# EAGLE design thermometer (EAGLE 5.06)
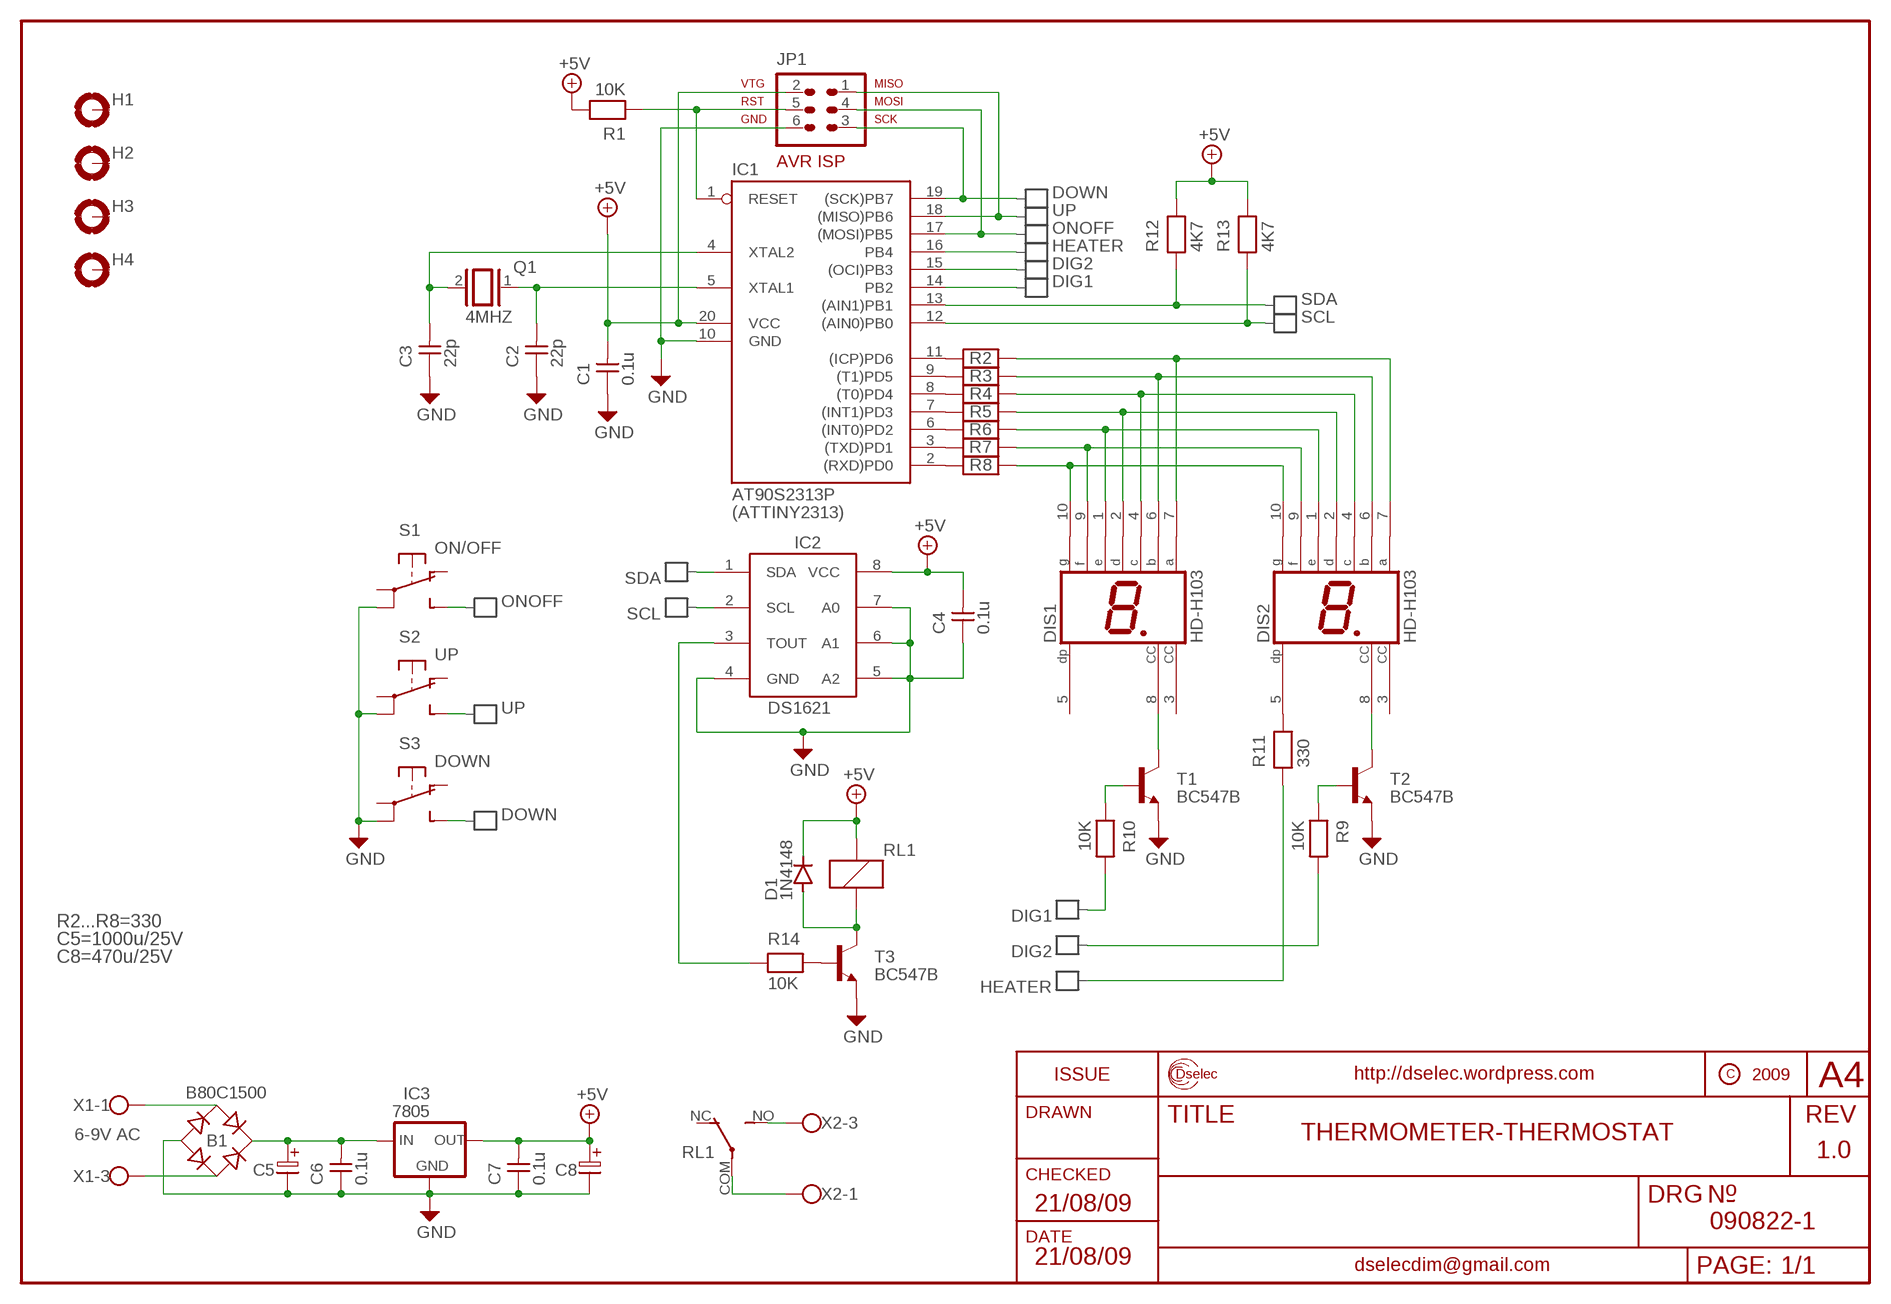
[diagram p0: schematic, sheet 1]

## Parts
B1  B80C1500  RB1A  [RB1A]
C1  0.1u  CAPNP-5  [C-5]
C2  22p  CAPNP-5  [C-5]
C3  22p  CAPNP-5  [C-5]
C4  0.1u  CAPNP-5  [C-5]
C5  ELC-5  [ES-5]
C6  0.1u  CAPNP-5  [C-5]
C7  0.1u  CAPNP-5  [C-5]
C8  ELC-5  [ES-5]
D1  1N4148  [DO35-10]
DIS1  HD-H103  [HDSP-M]
DIS2  HD-H103  [HDSP-M]
H1  MOUNT-PAD-ROUND3.0  [3,0-PAD]
H2  MOUNT-PAD-ROUND3.0  [3,0-PAD]
H3  MOUNT-PAD-ROUND3.0  [3,0-PAD]
H4  MOUNT-PAD-ROUND3.0  [3,0-PAD]
IC1  AT90S2313P  [DIL20]
IC2  DS1621  [DIL08]
IC3  7805  78XXL  [78XXL]
JP1  AVR-ISP-6  [AVR-ISP-6]
Q1  4MHZ  XTAL/S  [QS]
R1  10K  RESEU-10  [R-10]
R2  RESEU-10  [R-10]
R3  RESEU-10  [R-10]
R4  RESEU-10  [R-10]
R5  RESEU-10  [R-10]
R6  RESEU-10  [R-10]
R7  RESEU-10  [R-10]
R8  RESEU-10  [R-10]
R9  10K  RESEU-10  [R-10]
R10  10K  RESEU-10  [R-10]
R11  330  RESEU-10  [R-10]
R12  4K7  RESEU-10  [R-10]
R13  4K7  RESEU-10  [R-10]
R14  10K  RESEU-10  [R-10]
RL1  RELAYSPDTJSM1  [JSM1]
S1  ON/OFF  SRK  [SRK]
S2  UP  SRK  [SRK]
S3  DOWN  SRK  [SRK]
T1  BC547B  BC547B-NPN-TO92-EBC  [TO92-EBC]
T2  BC547B  BC547B-NPN-TO92-EBC  [TO92-EBC]
T3  BC547B  BC547B-NPN-TO92-EBC  [TO92-EBC]
X1  AK500/3  [AK500/3]
X2  AK500/3  [AK500/3]

## Nets
+5V: C1.2 C4.2 C7.2 C8.1 D1.C IC1.20(VCC) IC2.8(VCC) IC3.OUT JP1.2 R1.2 R12.2 R13.2 RL1.1
DIG1: IC1.14(PB2) R10.2
DIG2: IC1.15((OCI)PB3) R9.2
DOWN: IC1.19((SCK)PB7) JP1.3 S3.1(S)
GND: B1.- C1.1 C2.1 C3.1 C4.1 C5.2 C6.1 C7.1 C8.2 IC1.10(GND) IC2.4(GND) IC2.5(A2) IC2.6(A1) IC2.7(A0) IC3.GND JP1.6 S1.3(P) S2.3(P) S3.3(P) T1.E T2.E T3.E
HEATER: IC1.16(PB4) R11.1
N$4: DIS2.5(DP) R11.2
N$5: IC1.1(RESET) JP1.5 R1.1
N$6: RL1.NO(A:NO) X2.3
N$7: IC1.11((ICP)PD6) R2.1
N$8: IC1.9((T1)PD5) R3.1
N$9: IC1.8((T0)PD4) R4.1
N$10: IC1.7((INT1)PD3) R5.1
N$11: IC1.6((INT0)PD2) R6.1
N$12: IC1.3((TXD)PD1) R7.1
N$13: IC1.2((RXD)PD0) R8.1
N$14: C2.2 IC1.5(XTAL1) Q1.1
N$15: C3.2 IC1.4(XTAL2) Q1.2
N$16: DIS1.10(G) DIS2.10(G) R8.2
N$17: DIS1.9(F) DIS2.9(F) R7.2
N$18: DIS1.1(E) DIS2.1(E) R6.2
N$19: DIS1.2(D) DIS2.2(D) R5.2
N$20: DIS1.4(C) DIS2.4(C) R4.2
N$21: DIS1.6(B) DIS2.6(B) R3.2
N$22: DIS1.7(A) DIS2.7(A) R2.2
N$23: R10.1 T1.B
N$24: R9.1 T2.B
N$25: DIS1.8(CC) T1.C
N$26: DIS2.8(CC) T2.C
N$27: D1.A RL1.2 T3.C
N$28: R14.2 T3.B
N$29: RL1.COM(A:COM) X2.1
N$30: B1.AC1 X1.1
N$31: B1.AC2 X1.3
N$33: B1.+ C5.1 C6.2 IC3.IN
ONOFF: IC1.17((MOSI)PB5) JP1.4 S1.1(S)
OUT: IC2.3(TOUT) R14.1
SCL: IC1.12((AIN0)PB0) IC2.2(SCL) R13.1
SDA: IC1.13((AIN1)PB1) IC2.1(SDA) R12.1
UP: IC1.18((MISO)PB6) JP1.1 S2.1(S)
Unconnected: DIS1.3(CC) DIS1.5(DP) DIS2.3(CC) H1.B3,0(MOUNT) H2.B3,0(MOUNT) H3.B3,0(MOUNT) H4.B3,0(MOUNT) RL1.NC(A:NC) S1.2(P) S1.4(O) S2.2(P) S2.4(O) S3.2(P) S3.4(O) X1.2 X2.2

## Notes on the sheet
- (ATTINY2313)
- R2...R8=330
- C5=1000u/25V
- C8=470u/25V
- 6-9V AC | THERMOMETER-THERMOSTAT
- 1.0
- 21/08/09
- 090822-1
- 21/08/09

## Library data of the parts
B1 = rectifier:RB1A: RECTIFIER 1 A
C1-C4 C6 C7 = discrete:CAPNP-5
C5 C8 = discrete:ELC-5
D1 = QuantumOptics:1N4148: 1N4148, fast small signal silicon, 80V 125mAavg trr=4nSmax
DIS1 DIS2 = display-hp:HD-H103: LED DISPLAY 1-character 7 segment, decimal point right
H1-H4 = holes:MOUNT-PAD-ROUND: MOUNTING PAD, round
IC1 = atmel:AT90S2313: MICROCONTROLLER 2 Kbytes FLASH 128 bytes SRAM 128 bytes EEPROM UART
IC2 = maxim:DS1621
IC3 = v-reg:78XXL: VOLTAGE REGULATOR
JP1 = atmel:AVR-ISP-6: AVR ISP-6 Serial Programming Header
Q1 = special:XTAL/S: CRYSTAL
R1-R14 = discrete:RESEU-10
RL1 = ads4:RELAYSPDT: SPDT Relay
S1-S3 = switch-misc:SRK: SWITCH
T1-T3 = transistor:*-NPN-: NPN Transistror BF959 corrected 2008.03.06
X1 X2 = con-ptr500+:AK500/3: CONNECTOR

## Net classes
0 default: width 0.305 mm

## Board
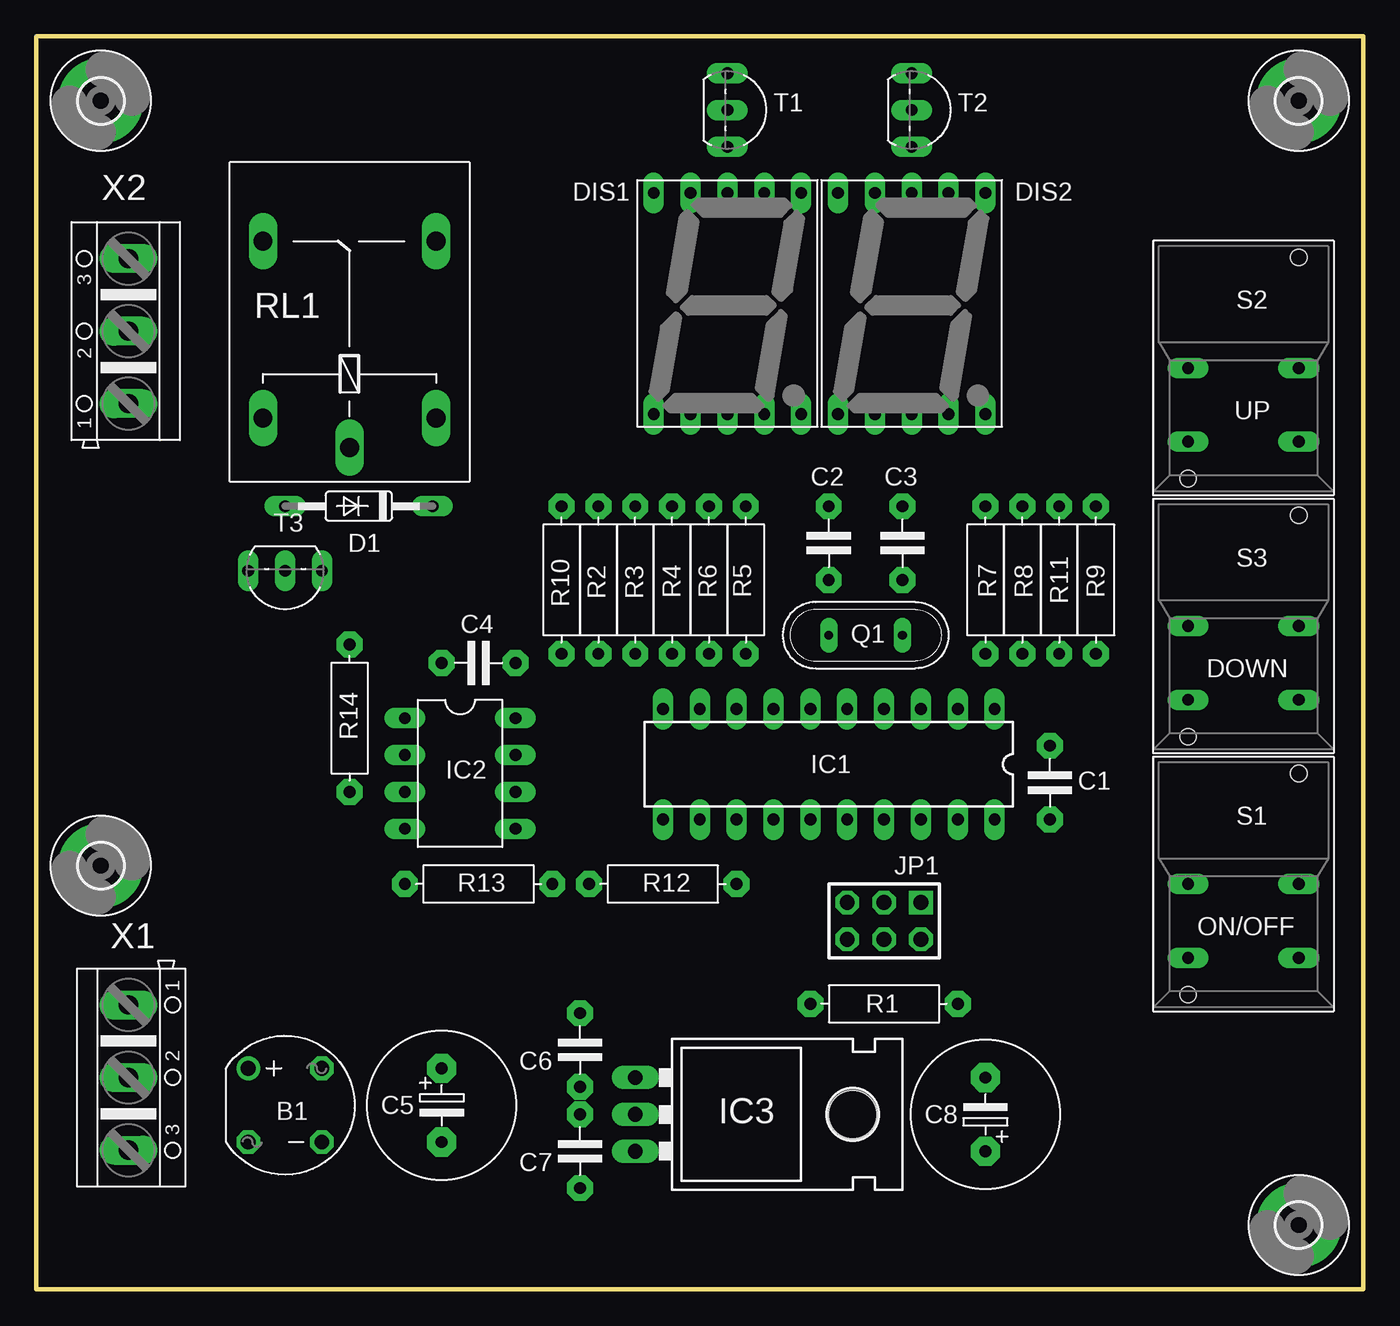
[diagram p1: board, top side]
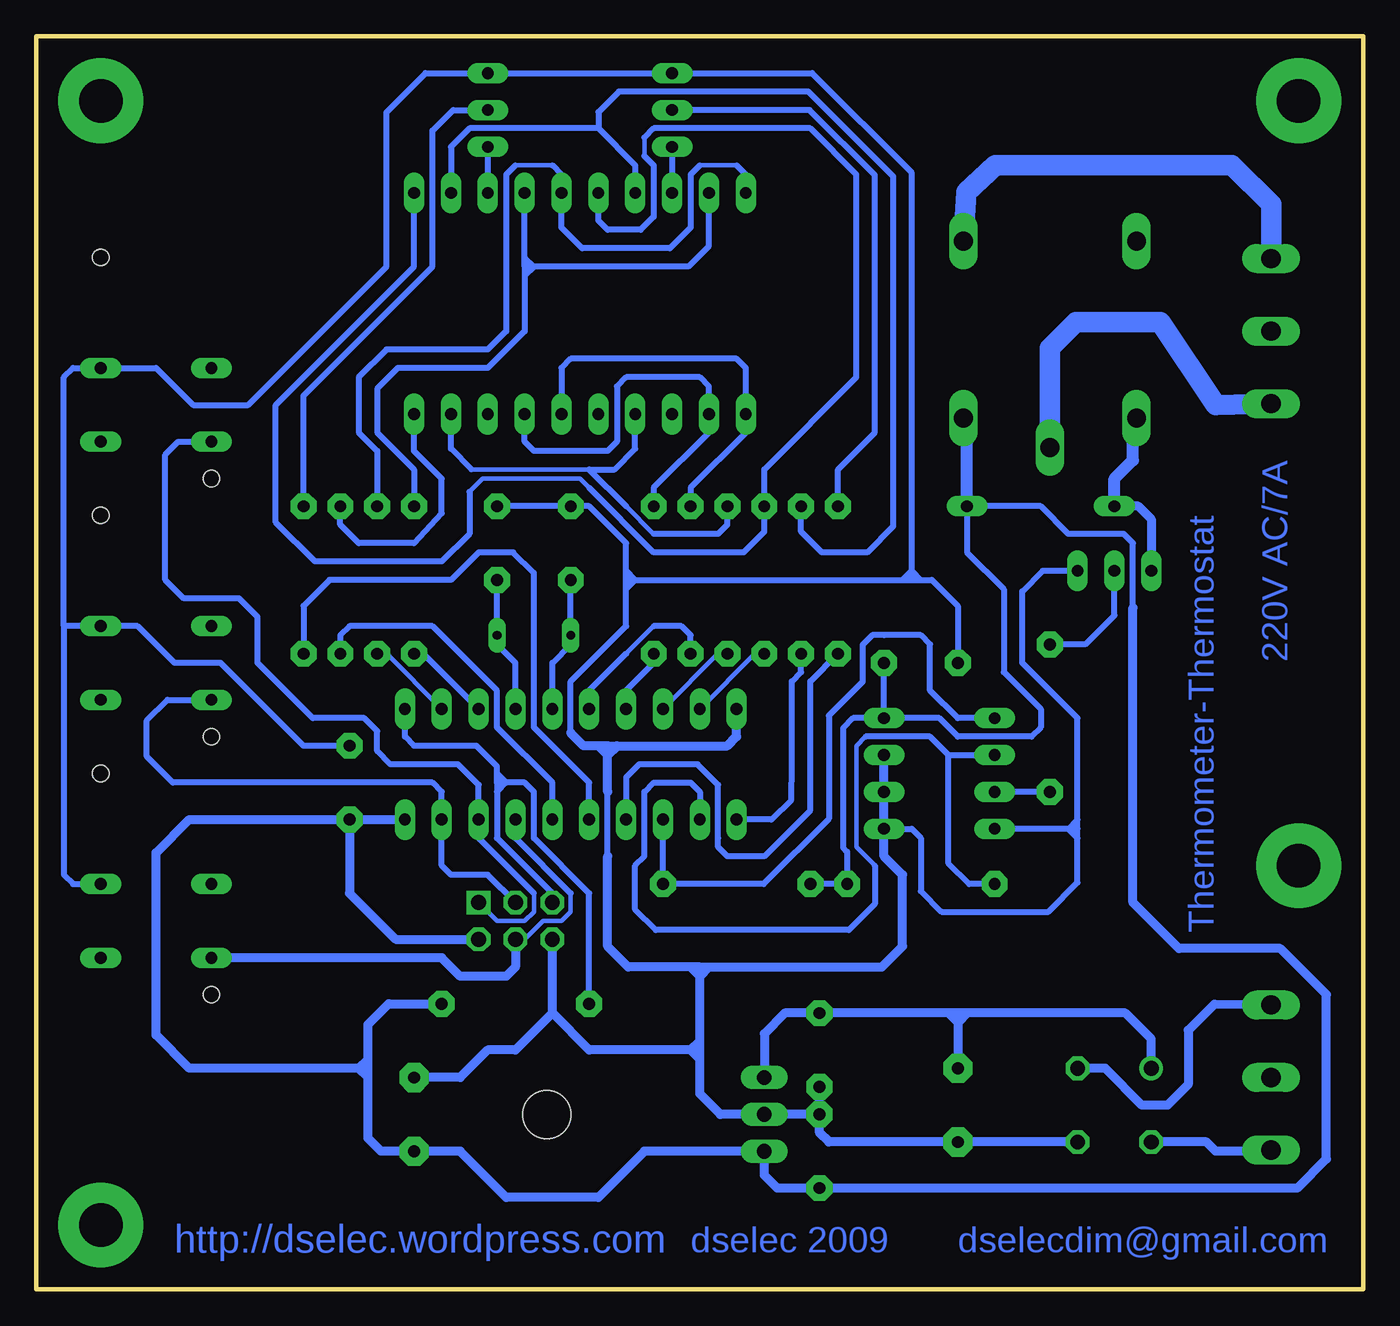
[diagram p2: board, bottom side, seen from below]

Size 91.44 x 86.36 mm. Coordinates in mm from the lower left corner, seen from the top.
Outline: 0,0 0,86.36 91.44,86.36 91.44,0 0,0
Copper layers (1*16): Top 0.035mm / dielectric 1.5mm / Bottom 0.035mm
Design rules "lpkf": minimum track width 12mil, minimum drill 25mil, track to track 12mil, track to pad 12mil, pad to pad 12mil, via to via 12mil, smd to smd 12mil, copper to edge 40mil, drill to drill 8mil, minimum pad ring 12mil, minimum via ring 12mil, stop-mask expansion 0mil, vias tented up to drill 0mil, thermal gap 10mil

### Footprints (pad centres in the part's own frame; a part is rotated, then mirrored left to right if it is on the bottom)
RB1A = drill 1.016 round: + -2.54,2.54 | drill 1.016 octagon: - 2.54,-2.54; AC1 2.54,2.54; AC2 -2.54,-2.54
C-5 = drill 0.813 pad 1.778 octagon: 1 -2.54,0; 2 2.54,0
ES-5 = drill 0.813 pad 2.007 octagon: 1 -2.54,0; 2 2.54,0
DO35-10 = drill 0.813 long: A 5.08,0; C -5.08,0
HDSP-M = drill 0.813 long: 1 -5.08,-7.62; 2 -2.54,-7.62; 3 0,-7.62; 4 2.54,-7.62; 5 5.08,-7.62; 6 5.08,7.62; 7 2.54,7.62; 8 0,7.62; 9 -2.54,7.62; 10 -5.08,7.62
3,0-PAD = drill 3 pad 5.842 round: B3,0 0,0
DIL20 = drill 0.813 long: 1 -11.43,-3.81; 2 -8.89,-3.81; 3 -6.35,-3.81; 4 -3.81,-3.81; 5 -1.27,-3.81; 6 1.27,-3.81; 7 3.81,-3.81; 8 6.35,-3.81; 9 8.89,-3.81; 10 11.43,-3.81; 11 11.43,3.81; 12 8.89,3.81; 13 6.35,3.81; 14 3.81,3.81; 15 1.27,3.81; 16 -1.27,3.81; 17 -3.81,3.81; 18 -6.35,3.81; 19 -8.89,3.81; 20 -11.43,3.81
DIL08 = drill 0.813 long: 1 -3.81,-3.81; 2 -1.27,-3.81; 3 1.27,-3.81; 4 3.81,-3.81; 5 3.81,3.81; 6 1.27,3.81; 7 -1.27,3.81; 8 -3.81,3.81
78XXL = drill 1.016 long: GND 0,-3.81; IN -2.54,-3.81; OUT 2.54,-3.81 | hole 3.302: 0,11.176
AVR-ISP-6 = drill 1.016 square: 1 -2.54,-1.27 | drill 1.016 octagon: 2 -2.54,1.27; 3 0,-1.27; 4 0,1.27; 5 2.54,-1.27; 6 2.54,1.27
QS = drill 0.61 long: 1 -2.54,0; 2 2.54,0
R-10 = drill 0.813 pad 1.778 octagon: 1 -5.08,0; 2 5.08,0
JSM1 = drill 1.3 long: 1 -5.993,-5.969; 2 -5.993,5.969; COM -8.025,0; NC 6.199,5.969; NO 6.199,-5.969
SRK = drill 0.813 long: 1 -3.81,-5.08; 2 -3.81,0; 3 3.81,0; 4 3.81,-5.08 | hole 1.118: -3.81,-7.62; 3.81,7.62
TO92-EBC = drill 0.813 long: B 0,-1.27; C 2.54,-1.27; E -2.54,-1.27
AK500/3 = drill 1.321 long: 1 -5.004,0; 2 0,0; 3 5.004,0

### Placement (x,y rotation side)
B1  17.14,12.7 0 top
C1  69.85,34.92 270 top
C2  54.61,51.44 270 top
C3  59.69,51.44 270 top
C4  30.48,43.18 0 top
C5  27.94,12.7 270 top
C6  37.47,16.51 90 top
C7  37.47,9.53 270 top
C8  65.41,12.06 90 top
D1  22.23,53.98 180 top
DIS1  47.62,67.94 0 top
DIS2  60.33,67.94 0 top
H1  4.45,81.92 0 top
H2  4.45,29.21 0 top
H3  87,4.45 0 top
H4  87,81.92 0 top
IC1  54.61,36.2 180 top
IC2  29.21,35.56 270 top
IC3  45.09,12.06 270 top
JP1  58.42,25.4 180 top
Q1  57.15,45.09 0 top
R1  58.42,19.68 0 top
R2  38.73,48.9 90 top
R3  41.27,48.9 90 top
R4  43.81,48.9 90 top
R5  48.9,48.9 90 top
R6  46.35,48.9 90 top
R7  65.41,48.9 90 top
R8  67.94,48.9 90 top
R9  73.03,48.9 270 top
R10  36.2,48.9 270 top
R11  70.48,48.9 90 top
R12  43.18,27.94 180 top
R13  30.48,27.94 0 top
R14  21.59,39.37 90 top
RL1  21.59,66.04 90 top
S1  83.19,27.94 0 top
S2  83.19,63.5 0 top
S3  83.19,45.72 0 top
T1  48.9,81.28 270 top
T2  61.59,81.28 270 top
T3  17.14,48.26 180 top
X1  6.35,14.61 270 top
X2  6.35,66.04 90 top

### Tracks (layer width: path | path; a pad name or v marks a point on that pad's centre or on a via)
+5V
  Bottom 0.406: R12.2 R13.2 35.56,30.16 35.84,30.45 35.84,38.67 35.15,39.37 IC2.8 | IC2.8 C4.2 | IC2.8 29.21,39.37 27.94,38.1 22.86,38.1 22.23,38.73 22.23,40.01 24.77,42.55 24.77,48.26 27.3,50.8 D1.C 22.23,53.98 20.32,52.07 16.51,52.07 15.88,51.44 15.88,46.99
  Bottom 0.61: C1.2 IC1.20 | C1.2 69.85,27.3 66.67,24.13 JP1.2 | 68.58,15.24 68.58,15.88 | 68.58,15.88 68.58,18.27 67.16,19.68 R1.2 | 68.58,14.61 68.58,10.42 67.68,9.53 C8.1 62.23,9.53 59.05,6.35 52.7,6.35 49.53,9.53 IC3.OUT 41.27,7.88 40.38,6.99 C7.2 4.55,6.99 2.54,8.99 2.54,20.32 5.71,23.5 12.7,23.5 15.88,26.67 15.88,46.99 | 68.58,14.61 68.58,15.24 | 68.58,15.24 69.22,15.24 | 69.22,15.24 80.89,15.24 83.19,17.53 83.19,30.1 80.89,32.38 C1.2 | 69.22,15.24 68.58,15.88 | 68.58,14.61 69.22,15.24
  Bottom 0.813: D1.C 27.3,58.42 RL1.1
DIG1
  Bottom 0.406: R10.2 38.1,41.91 38.1,33.02 41.27,29.84 43.81,29.84 44.45,30.48 44.45,31.11 44.45,34.77 45.87,36.2 49.9,36.2 50.8,35.3 IC1.14
DIG2
  Bottom 0.406: IC1.15 53.34,34.92 57.15,38.73 57.15,49.38 58.57,50.8 60.96,50.8 62.87,48.9 71.23,48.9 73.03,47.1 R9.2
DOWN
  Bottom 0.406: JP1.3 60.33,28.57 62.87,28.57 63.5,29.21 IC1.19 63.5,34.29 64.14,34.92 82.02,34.92 83.82,36.72 83.82,39.22 82.4,40.64 S3.1
GND
  Bottom 0.406: 31.11,48.9 30.48,48.9 | 30.48,48.9 29.74,48.9 27.94,47.1 C4.1 | 50.8,48.9 50.16,48.9 | 50.16,48.9 31.75,48.9 | 31.75,48.9 31.11,48.9 | 50.8,48.9 50.8,49.53 | 50.8,49.53 50.8,51.44 53.34,53.98 C2.1 C3.1 | 19.68,31.11 19.68,28.04 21.69,26.04 29.06,26.04 30.48,27.45 30.48,31.11 31.11,31.75 IC2.5 | 19.68,31.11 19.68,31.75 | 19.68,31.75 20.32,31.75 | 20.32,31.75 IC2.4 | T3.E 22.07,49.53 23.5,48.11 23.5,43.18 19.68,39.37 19.68,32.38 | 19.68,31.75 19.68,32.38 | 52.07,29.84 52.07,34.29 | 50.8,48.26 50.8,45.72 54.61,41.91 54.61,38.36 | 50.8,48.26 50.8,48.9 | 89.53,45.72 89.53,28.57 88.9,27.94 S1.3 | 89.53,45.72 S3.3 84.45,45.72 81.92,43.18 78.74,43.18 73.03,37.47 C1.1 | 89.53,45.72 89.53,62.87 88.9,63.5 S2.3 83.19,63.5 80.64,60.96 76.83,60.96 67.31,70.48 67.31,81.13 64.62,83.82 T2.E T1.E 37.98,83.82 31.11,76.95 31.11,49.53 | 31.11,48.9 31.11,49.53 | 50.16,48.9 50.8,49.53 | 50.8,48.26 50.16,48.9 | 31.75,48.9 31.11,49.53 | 31.11,49.53 30.48,48.9 | 20.32,31.75 19.68,32.38 | 19.68,31.11 20.32,31.75
  Bottom 0.61: IC2.7 IC2.6 IC2.5 33.02,29.84 31.75,28.57 31.75,23.64 33.17,22.23 45.09,22.23 | 55.88,19.05 58.42,16.51 60.33,16.51 62.23,14.61 C8.2 | B1.- C5.2 36.83,10.16 37.47,10.79 C7.1 | C7.1 C6.1 | 45.72,22.23 46.35,22.23 | 46.35,22.23 50.65,22.23 52.07,23.64 52.07,29.84 | 52.07,34.29 52.07,36.83 | 52.07,36.83 52.07,37.47 | 52.07,37.47 51.44,37.47 | 51.44,37.47 43.81,37.47 43.18,38.1 IC1.10 | 45.72,15.88 45.72,13.48 44.3,12.06 IC3.GND C7.1 | 45.72,15.88 45.72,16.51 | 45.72,16.51 45.72,17.14 | 45.72,17.14 45.72,21.59 | 45.72,21.59 45.72,22.23 | 45.72,16.51 46.35,16.51 | 46.35,16.51 53.34,16.51 55.88,19.05 | 55.88,19.05 JP1.6 | 45.72,22.23 45.09,22.23 | 52.07,37.47 52.7,37.47 | 52.7,37.47 53.71,37.47 54.61,38.36 | 46.35,16.51 45.72,17.14 | 45.72,15.88 46.35,16.51 | 52.07,36.83 52.7,37.47 | 52.07,36.83 51.44,37.47 | 45.72,21.59 46.35,22.23 | 45.72,21.59 45.09,22.23
HEATER
  Bottom 0.406: IC1.16 55.88,34.92 59.69,38.73 59.69,41.27 64.14,45.72 69.85,45.72 70.48,45.09 R11.1
N$4
  Bottom 0.406: DIS2.5 65.41,57.78 63.5,55.88 63.5,53.49 65.41,51.44 69.22,51.44 70.48,52.7 R11.2
N$5
  Bottom 0.406: 59.69,34.92 59.69,34.29 | 59.69,34.29 59.69,31.11 55.88,27.3 JP1.5 | 59.69,34.92 59.69,35.56 | 59.69,35.56 59.69,36.05 61.11,37.47 65.41,37.47 66.04,38.1 IC1.1 | 59.05,34.92 57.78,34.92 57.15,34.29 57.15,31.11 53.34,27.3 R1.1 | 59.05,34.92 59.69,34.92 | 59.05,34.92 59.69,35.56 | 59.05,34.92 59.69,34.29
N$6
  Bottom 1.422: X2.3 6.35,74.78 9.04,77.47 25.36,77.47 27.34,75.61 RL1.NO
N$7
  Bottom 0.406: IC1.11 40.78,32.38 39.4,33.74 39.37,36.2 39.37,41.91 38.73,42.55 R2.1
N$8
  Bottom 0.305: 41.91,43.81 IC1.9
  Bottom 0.406: R3.1 41.91,43.81
N$9
  Bottom 0.305: 44.45,43.81 IC1.8
  Bottom 0.406: R4.1 44.45,43.81
N$10
  Bottom 0.406: IC1.7 50.8,41.27 48.9,43.18 R5.1
N$11
  Bottom 0.305: 48.9,45.72 50.8,43.81
  Bottom 0.406: 50.8,43.81 53.34,41.27 IC1.6 | R6.1 46.35,45.09 46.99,45.72 48.9,45.72
N$12
  Bottom 0.406: IC1.3 64.77,43.81 R7.1
N$13
  Bottom 0.305: IC1.2 67.31,43.81 R8.1
N$14
  Bottom 0.406: C2.2 Q1.1 54.61,44.45 55.88,43.18 IC1.5
N$15
  Bottom 0.406: C3.2 Q1.2 59.69,44.45 58.42,43.18 IC1.4
N$16
  Bottom 0.305: 43.18,77.47 45.72,77.47 | 55.88,77.47 58.42,77.47
  Bottom 0.406: 45.72,77.47 46.35,76.83 46.35,73.17 47.77,71.75 53.83,71.75 55.24,73.17 DIS2.10 55.24,76.83 55.88,77.47 | DIS1.10 42.55,76.83 43.18,77.47 | 58.42,77.47 59.05,76.83 59.05,66.04 60.33,64.77 67.31,64.77 69.22,62.87 69.22,59.05 67.94,57.78 R8.2
N$17
  Bottom 0.406: 57.15,70.48 46.51,70.48 45.09,71.91 DIS1.9 | 57.15,70.48 57.78,70.48 | 57.78,70.48 57.78,69.85 | 57.78,69.85 57.78,66.04 60.33,63.5 66.53,63.5 67.94,62.08 67.94,59.05 65.41,56.52 R7.2 | 57.78,70.48 57.78,71.12 | 57.78,71.12 DIS2.9 | 57.15,70.48 57.78,71.12 | 57.15,70.48 57.78,69.85
N$18
  Bottom 0.406: R6.2 46.35,55.24 42.55,59.05 DIS1.1 42.55,63.5 43.18,64.14 54.61,64.14 55.24,63.5 DIS2.1
N$19
  Bottom 0.406: R5.2 48.9,55.24 45.09,59.05 DIS1.2 45.09,62.23 45.72,62.87 50.8,62.87 51.44,62.23 51.44,58.42 52.07,57.78 57.15,57.78 57.78,58.42 DIS2.2
N$20
  Bottom 0.305: 53.34,56.52 61.45,56.52 | 48.9,52.07 50.8,53.98
  Bottom 0.406: DIS1.4 50.16,57.94 51.59,56.52 53.34,56.52 50.8,53.98 | 61.45,56.52 62.87,57.94 DIS2.4 | 48.9,52.07 44.45,52.07 43.81,52.7 R4.2
N$21
  Bottom 0.305: 49.53,79.38 49.53,78.11 | 61.59,54.98 60.7,55.88 53.98,55.88 53.34,55.24
  Bottom 0.406: 49.53,78.11 48.9,77.47 48.9,73.92 49.79,73.03 52.07,73.03 52.7,73.66 DIS1.6 | 49.53,79.38 48.9,80.01 38.1,80.01 34.92,76.83 34.92,62.87 41.27,56.52 R3.2 41.27,52.22 42.7,50.8 48.9,50.8 53.34,55.24 | 61.59,54.98 61.59,52.07 63.5,50.16 72.24,50.16 74.93,52.85 74.93,60.96 65.41,70.48 DIS2.6
N$22
  Bottom 0.406: 52.7,80.01 61.59,80.01 62.87,78.74 DIS2.7 | 52.7,80.01 50.16,77.47 DIS1.7 | 52.7,80.01 52.7,81.13 51.28,82.55 38.24,82.55 32.38,76.7 32.38,52.6 34.18,50.8 37.31,50.8 38.73,52.22 R2.2
N$23
  Bottom 0.406: R10.1 36.2,56.52 33.66,59.05 33.66,76.79 38.15,81.28 T1.B
N$24
  Bottom 0.406: T2.B 62.72,81.28 64.14,79.86 64.14,70.48 73.03,61.59 R9.1
N$25
  Bottom 0.406: T1.C DIS1.8
N$26
  Bottom 0.406: T2.C DIS2.8
N$27
  Bottom 0.61: T3.C 14.61,53.08 15.5,53.98 D1.A
  Bottom 0.813: D1.A 17.14,55.88 15.88,57.15 15.88,59.69 RL1.2
N$28
  Bottom 0.406: R14.2 19.15,44.45 17.14,46.46 T3.B
N$29
  Bottom 1.422: RL1.COM 21.59,64.88 19.79,66.67 13.97,66.67 10.16,60.96 X2.1
N$30
  Bottom 0.61: B1.AC1 17.78,15.24 15.24,12.7 13.48,12.7 12.06,14.12 12.06,17.86 10.24,19.66 X1.1
N$31
  Bottom 0.61: B1.AC2 10.79,10.16 10.16,9.53 7.62,9.53 X1.3
N$33
  Bottom 0.61: IC3.IN 41.27,17.63 39.85,19.05 C6.2 28.57,19.05 | B1.+ 14.61,17.25 16.4,19.05 27.3,19.05 | 27.3,19.05 27.94,19.05 | 27.94,19.05 28.57,19.05 | 27.94,19.05 27.94,18.41 | 27.94,18.41 C5.1 | 27.94,18.41 28.57,19.05 | 27.3,19.05 27.94,18.41
ONOFF
  Bottom 0.305: 54.61,27.3 54.61,26.04 55.24,25.4 56.52,25.4 57.78,24.13 JP1.4
  Bottom 0.406: 54.61,27.3 58.42,31.11 IC1.17
  Bottom 0.61: S1.1 63.5,22.86 62.23,21.59 59.05,21.59 58.42,22.23 JP1.4
OUT
  Bottom 0.406: R14.1 IC2.3
SCL
  Bottom 0.305: 33.66,29.21 34.92,30.48 34.92,37.47 34.29,38.1
  Bottom 0.406: 33.66,29.21 33.66,26.56 35.45,24.77 48.74,24.77 50.16,26.18 50.16,29.21 49.53,29.84 49.53,34.29 48.9,34.92 46.35,34.92 45.72,34.29 IC1.12 | 34.29,38.1 29.84,38.1 28.57,36.83 | 28.57,36.83 IC2.2 | R13.1 27.16,27.94 28.57,29.36 28.57,36.83
SDA
  Bottom 0.406: IC1.13 R12.1 41.32,27.94 36.83,32.43 36.83,39.55 34.51,41.88 34.51,44.41 33.84,45.09 33.02,45.09 30.48,45.09 29.84,44.45 29.84,41.27 27.94,39.37 IC2.1
UP
  Bottom 0.305: 57.15,27.3 57.15,26.04 57.78,25.4 59.69,25.4 JP1.1
  Bottom 0.406: 57.15,27.3 60.96,31.11 IC1.18 60.96,34.77 62.38,36.2 67.05,36.2 67.94,37.09 67.94,38.47 68.84,39.37 72.39,39.37 76.2,43.18 76.2,46.35 77.47,47.62 81.28,47.62 82.55,48.9 82.55,57.52 81.65,58.42 S2.1

### Text on the board
Bottom: 220V AC/7A | Thermometer-Thermostat | dselecdim@gmail.com | dselec 2009 | http://dselec.wordpress.com